# EAGLE design telly_light (EAGLE 9.6.2)

## Sheet 1 of 2
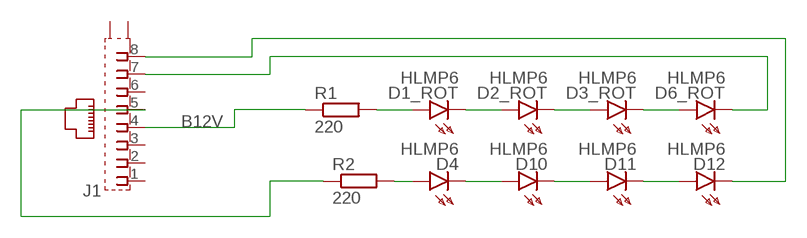
[diagram p0: schematic, sheet 1]

### Parts
D1_ROT  HLMP6  [HLMP6]
D2_ROT  HLMP6  [HLMP6]
D3_ROT  HLMP6  [HLMP6]
D4  HLMP6  [HLMP6]
D6_ROT  HLMP6  [HLMP6]
D10  HLMP6  [HLMP6]
D11  HLMP6  [HLMP6]
D12  HLMP6  [HLMP6]
J1  555153-1  [555153-1]
R1  220  R-EU_0204/7  [0204/7]
R2  220  R-EU_0204/7  [0204/7]

### Nets
B12V: J1.5 R2.1
N$1: D1_ROT.A R1.2
N$2: D1_ROT.K D2_ROT.A
N$3: D2_ROT.K D3_ROT.A
N$4: D3_ROT.K D6_ROT.A
N$5: D4.K D10.A
N$6: D10.K D11.A
N$7: D11.K D12.A
N$8: D4.A R2.2
N$9: J1.4 R1.1
N$10: D12.K J1.8
N$11: D6_ROT.K J1.7
Unconnected: J1.1 J1.2 J1.3 J1.6 J1.G1(S1) J1.G2(S2)

## Sheet 2 of 2
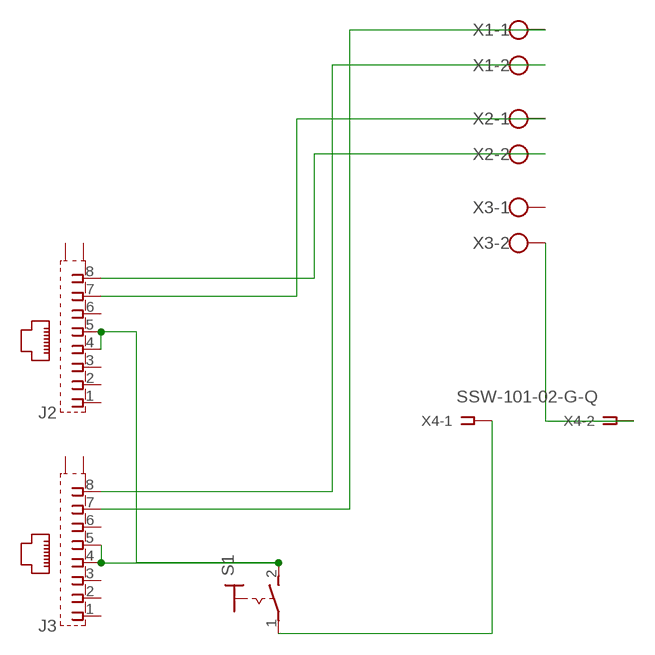
[diagram p1: schematic, sheet 2]

### Parts
J2  555153-1  [555153-1]
J3  555153-1  [555153-1]
S1  MS243  [MS243]
X1  W237-102  [W237-102]
X2  W237-102  [W237-102]
X3  W237-102  [W237-102]
X4  SSW-101-02-G-Q  [SSW-101-02-G-Q]

### Nets
N$12: X3.2 X4.2
N$13: S1.1(P) X4.1
N$14: J2.7 X2.1
N$15: J2.4 J2.5 J3.4 J3.5 S1.2(S)
N$16: J2.8 X2.2
N$17: J3.8 X1.2
N$18: J3.7 X1.1
Unconnected: J2.1 J2.2 J2.3 J2.6 J2.G1(S1) J2.G2(S2) J3.1 J3.2 J3.3 J3.6 J3.G1(S1) J3.G2(S2) X3.1

## Library data of the parts
D1_ROT D2_ROT D3_ROT D4 D6_ROT D10-D12 = display-hp:HLMP6: LED 2mm horizontal; MF: AGILENT TECHNOLOGIES; MPN: HLMP-6500; OC_FARNELL: 1652490; OC_NEWARK: 40K0088
J1-J3 = con-amp:555153-1: AMP connector
R1 R2 = rcl:R-EU_: RESISTOR, European symbol; SPICEPREFIX: R
S1 = switch:MS243: TOGGLE SWITCH
X1-X3 = con-wago-500:W237-102: WAGO SCREW CLAMP; MPN: 237-102; OC_FARNELL: unknown; OC_NEWARK: 70K9898
X4 = con-samtec:SSW-101-02-G: THROUGH-HOLE .025" SQ POST SOCKET Source: Samtec SSW.pdf; MF: Samtec Inc.; MPN: SSW-101-02-G-Q

## Board
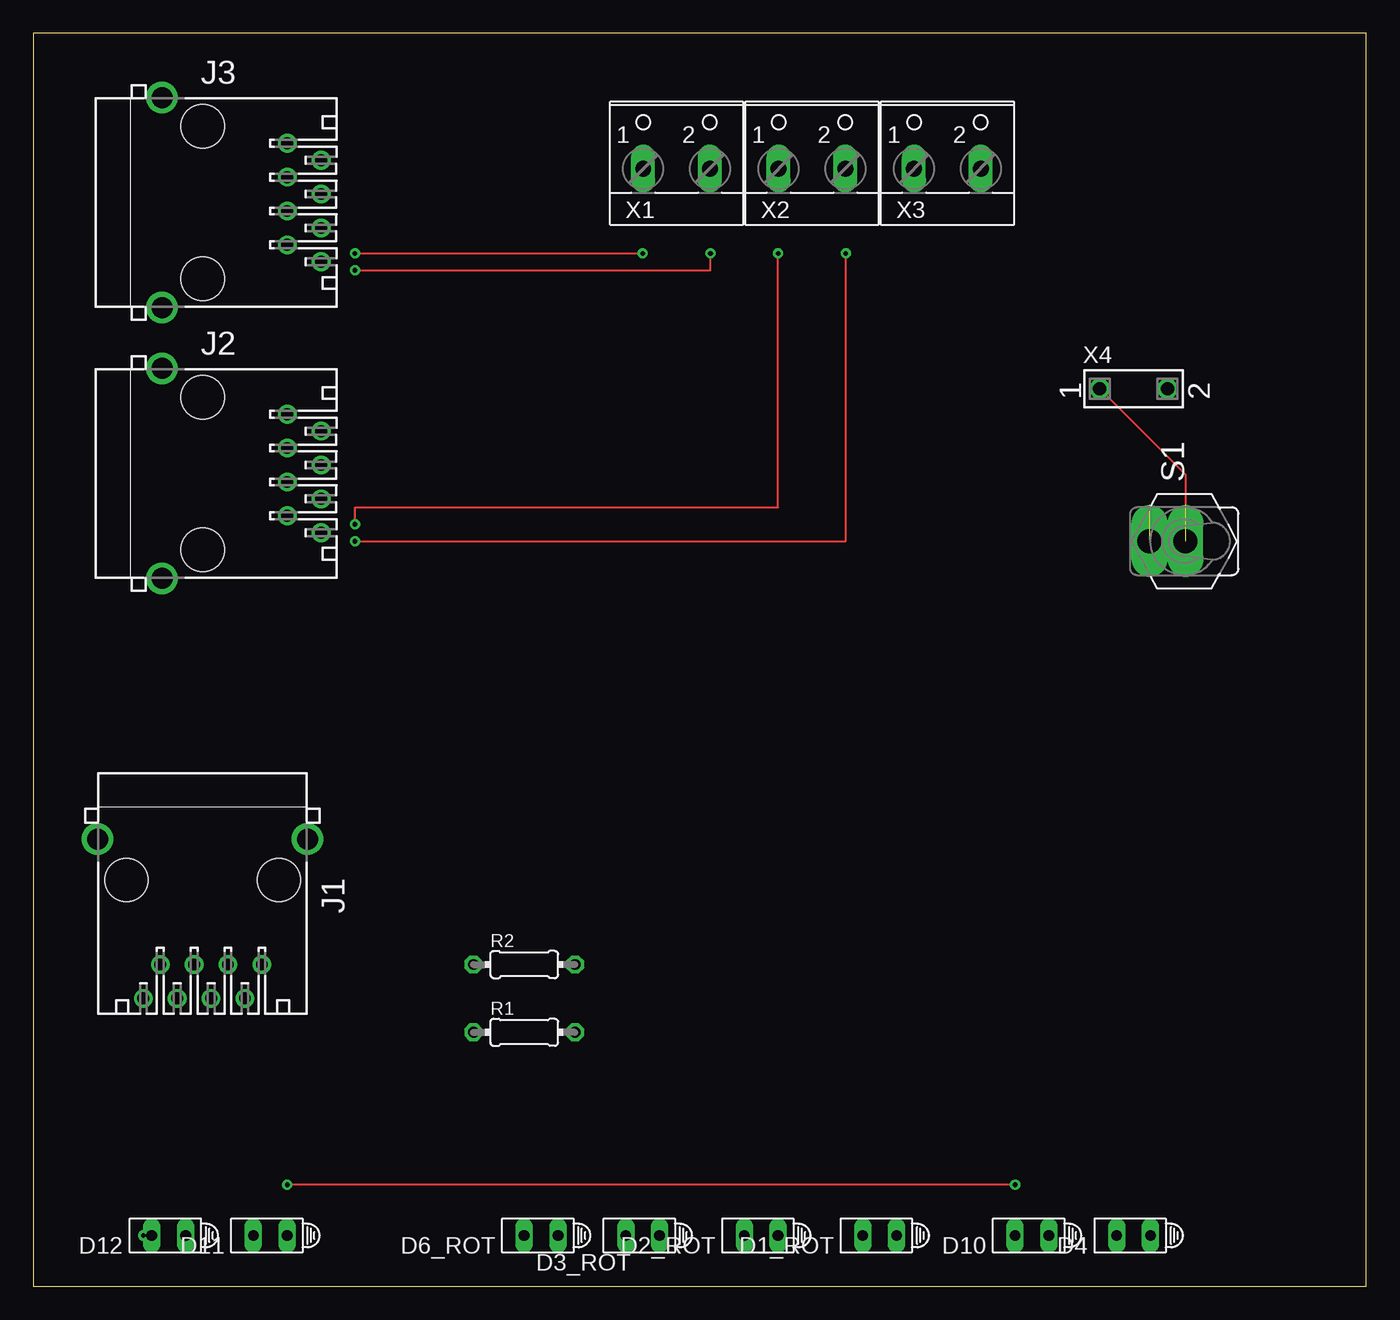
[diagram p2: board, top side]
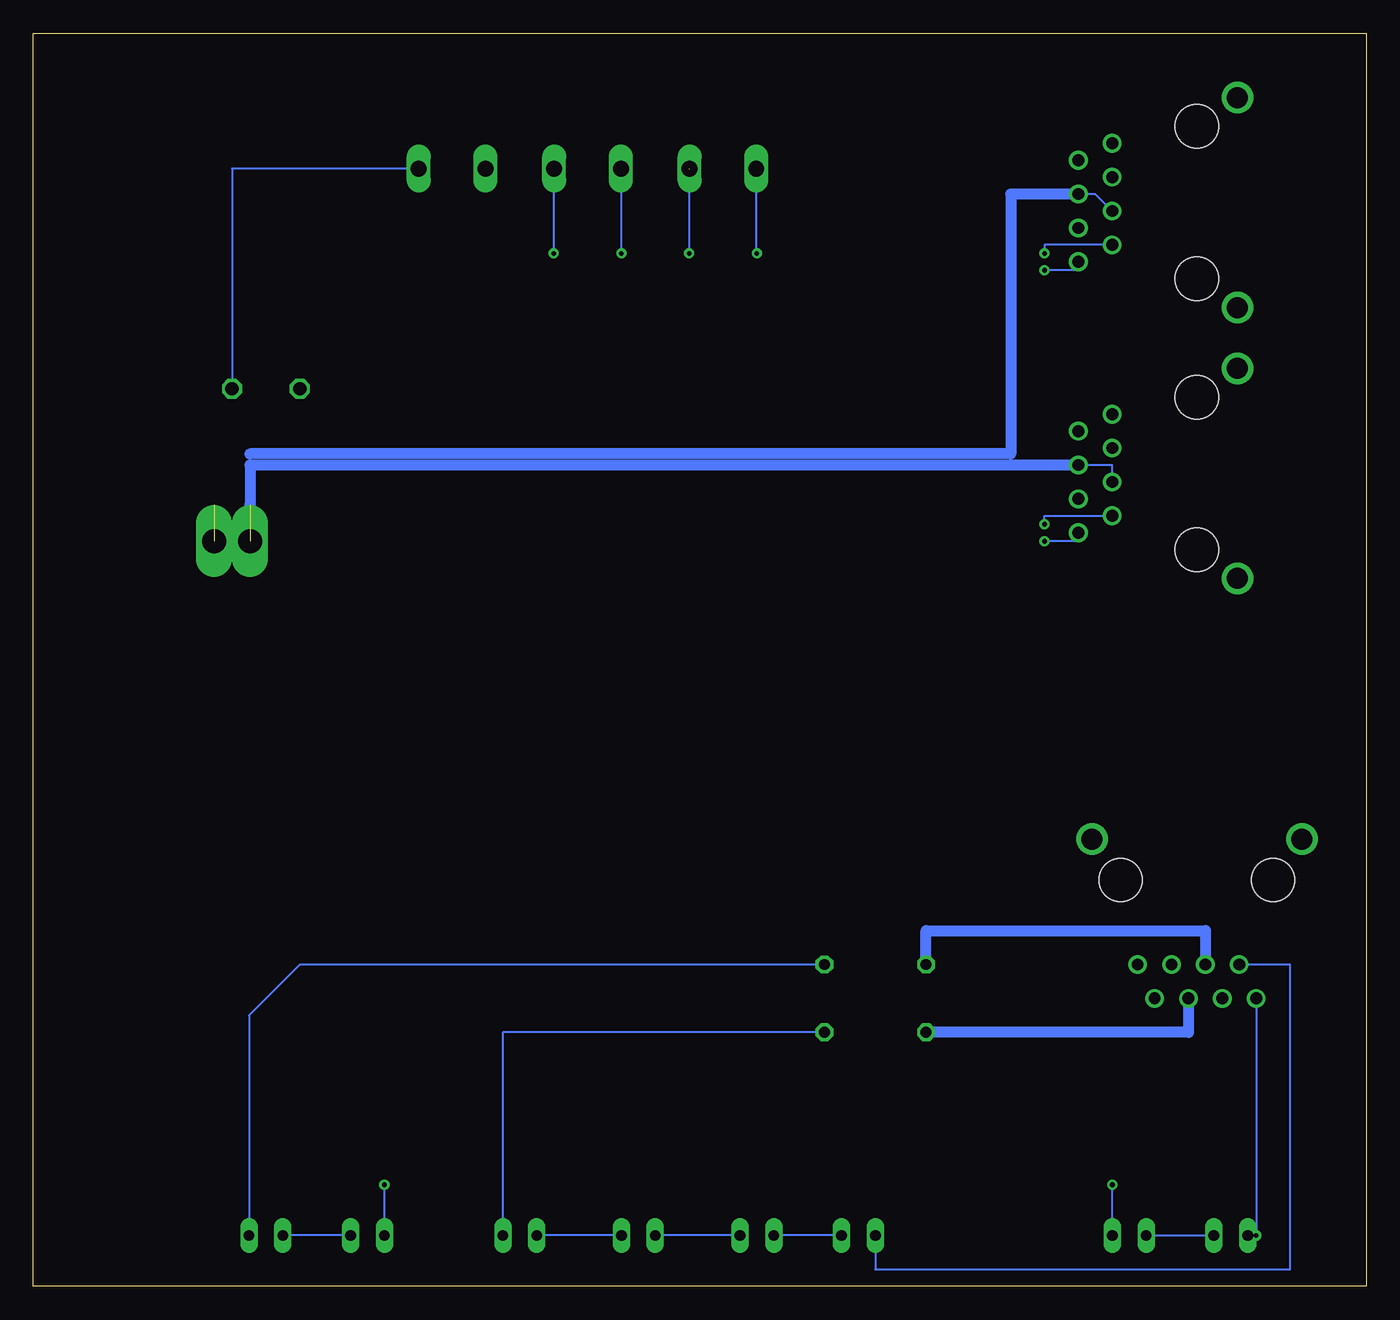
[diagram p3: board, bottom side, seen from below]

Size 100 x 93.97 mm. Coordinates in mm from the lower left corner, seen from the top.
Outline: 0,0 100,0 100,93.97 0,93.97 0,0
Copper layers (1*16): Top 0.035mm / dielectric 1.5mm / Bottom 0.035mm
Design rules "default": minimum track width 6mil, minimum drill 0.35mm, track to track 6mil, track to pad 6mil, pad to pad 6mil, via to via 6mil, smd to smd 6mil, copper to edge 40mil, drill to drill 6mil, minimum pad ring 10mil, minimum via ring 8mil, stop-mask expansion 4mil, vias tented up to drill 0mil, thermal gap 10mil

### Footprints (pad centres in the part's own frame; a part is rotated, then mirrored left to right if it is on the bottom)
HLMP6 = drill 0.813 long: A -1.27,0; K 1.27,0
555153-1 = drill 0.889: 1 -4.445,6.35; 2 -3.175,8.89; 3 -1.905,6.35; 4 -0.635,8.89; 5 0.635,6.35; 6 1.905,8.89; 7 3.175,6.35; 8 4.445,8.89 | drill 1.575 pad 2.184: G1 -7.874,-3.048; G2 7.874,-3.048 | hole 3.251: -5.715,0; 5.715,0
0204/7 = drill 0.813 octagon: 1 -3.81,0; 2 3.81,0
MS243 = drill 1.803 pad 2 long: 1 0,-1.346; 2 0,1.346
W237-102 = drill 1.194 long: 1 -2.5,-1.27; 2 2.5,-1.27
SSW-101-02-G-Q = drill 1 pad 1.5 octagon: 1 0,-2.54; 2 0,2.54

### Placement (x,y rotation side)
D1_ROT  63.5,3.81 180 top
D2_ROT  54.61,3.81 180 top
D3_ROT  45.72,3.81 180 top
D4  82.55,3.81 180 top
D6_ROT  38.1,3.81 180 top
D10  74.93,3.81 180 top
D11  17.78,3.81 180 top
D12  10.16,3.81 180 top
J1  12.7,30.48 180 top
J2  12.7,60.96 270 top
J3  12.7,81.28 270 top
R1  36.83,19.05 0 top
R2  36.83,24.13 0 top
S1  85.09,55.88 90 top
X1  48.26,85.09 0 top
X2  58.42,85.09 0 top
X3  68.58,85.09 0 top
X4  82.55,67.31 270 top

### Tracks (layer width: path | path; a pad name or v marks a point on that pad's centre or on a via)
B12V
  Bottom 0.813: R2.1 33.02,26.67 12.06,26.67 J1.5
N$1
  Bottom 0.152: R1.2 64.77,19.05 D1_ROT.A
N$2
  Bottom 0.152: D2_ROT.A D1_ROT.K
N$3
  Bottom 0.152: D3_ROT.A D2_ROT.K
N$4
  Bottom 0.152: D6_ROT.A D3_ROT.K
N$5
  Bottom 0.152: D10.A D4.K
N$6  (via drill 0.35)
  Top 0.152: v73.66,7.62 v19.05,7.62
  Bottom 0.152: D11.A v19.05,7.62 | D10.K v73.66,7.62
N$7
  Bottom 0.152: D11.K D12.A
N$8
  Bottom 0.152: R2.2 80.01,24.13 83.82,20.32 D4.A
N$9
  Bottom 0.813: J1.4 13.34,19.05 R1.1
N$10  (via drill 0.35)
  Top 0.152: D12.K v8.26,3.81
  Bottom 0.152: J1.8 v8.26,3.81
N$11
  Bottom 0.152: D6_ROT.K 36.83,1.27 5.71,1.27 5.71,24.13 J1.7
N$12
  Bottom 0.152: X3.2 85.09,83.82 X4.2
N$13  (1 unrouted)
  Top 0.152: X4.1 86.44,60.88 86.44,58.62
N$14  (via drill 0.35)
  Top 0.152: v24.13,57.15 24.13,58.42 55.88,58.42 v55.88,77.47
  Bottom 0.152: J2.7 24.13,57.78 v24.13,57.15 | X2.1 55.92,77.47 v55.88,77.47
N$15  (1 unrouted)
  Bottom 0.152: J3.5 20.32,81.92 J3.4 | J2.5 19.05,61.59 J2.4 | 83.74,61.59 83.74,62.43
  Bottom 0.813: J3.4 26.67,81.92 26.67,62.43 83.74,62.43 | J2.4 83.74,61.59 83.74,58.62
N$16  (via drill 0.35)
  Top 0.152: v24.13,55.88 60.96,55.88 v60.96,77.47
  Bottom 0.152: J2.8 21.59,55.88 v24.13,55.88 | X2.2 60.96,83.82 v60.96,77.47
N$17  (via drill 0.35)  (1 unrouted)
  Top 0.152: v24.13,76.2 50.8,76.2 v50.8,77.47
  Bottom 0.152: 50.8,83.82 v50.8,77.47 | J3.8 21.59,76.2 v24.13,76.2
N$18  (via drill 0.35)
  Top 0.152: v24.13,77.47 v45.72,77.47
  Bottom 0.152: v45.72,77.47 45.76,77.47 X1.1 | J3.7 24.13,78.11 v24.13,77.47